# Altium project PPC_notebook_electrical_schematics_v0.7.PrjPcb (part 7 of 14)

## Sheet 16 SATA3 CONTROLLER.SchDoc
size 420 x 297 mm
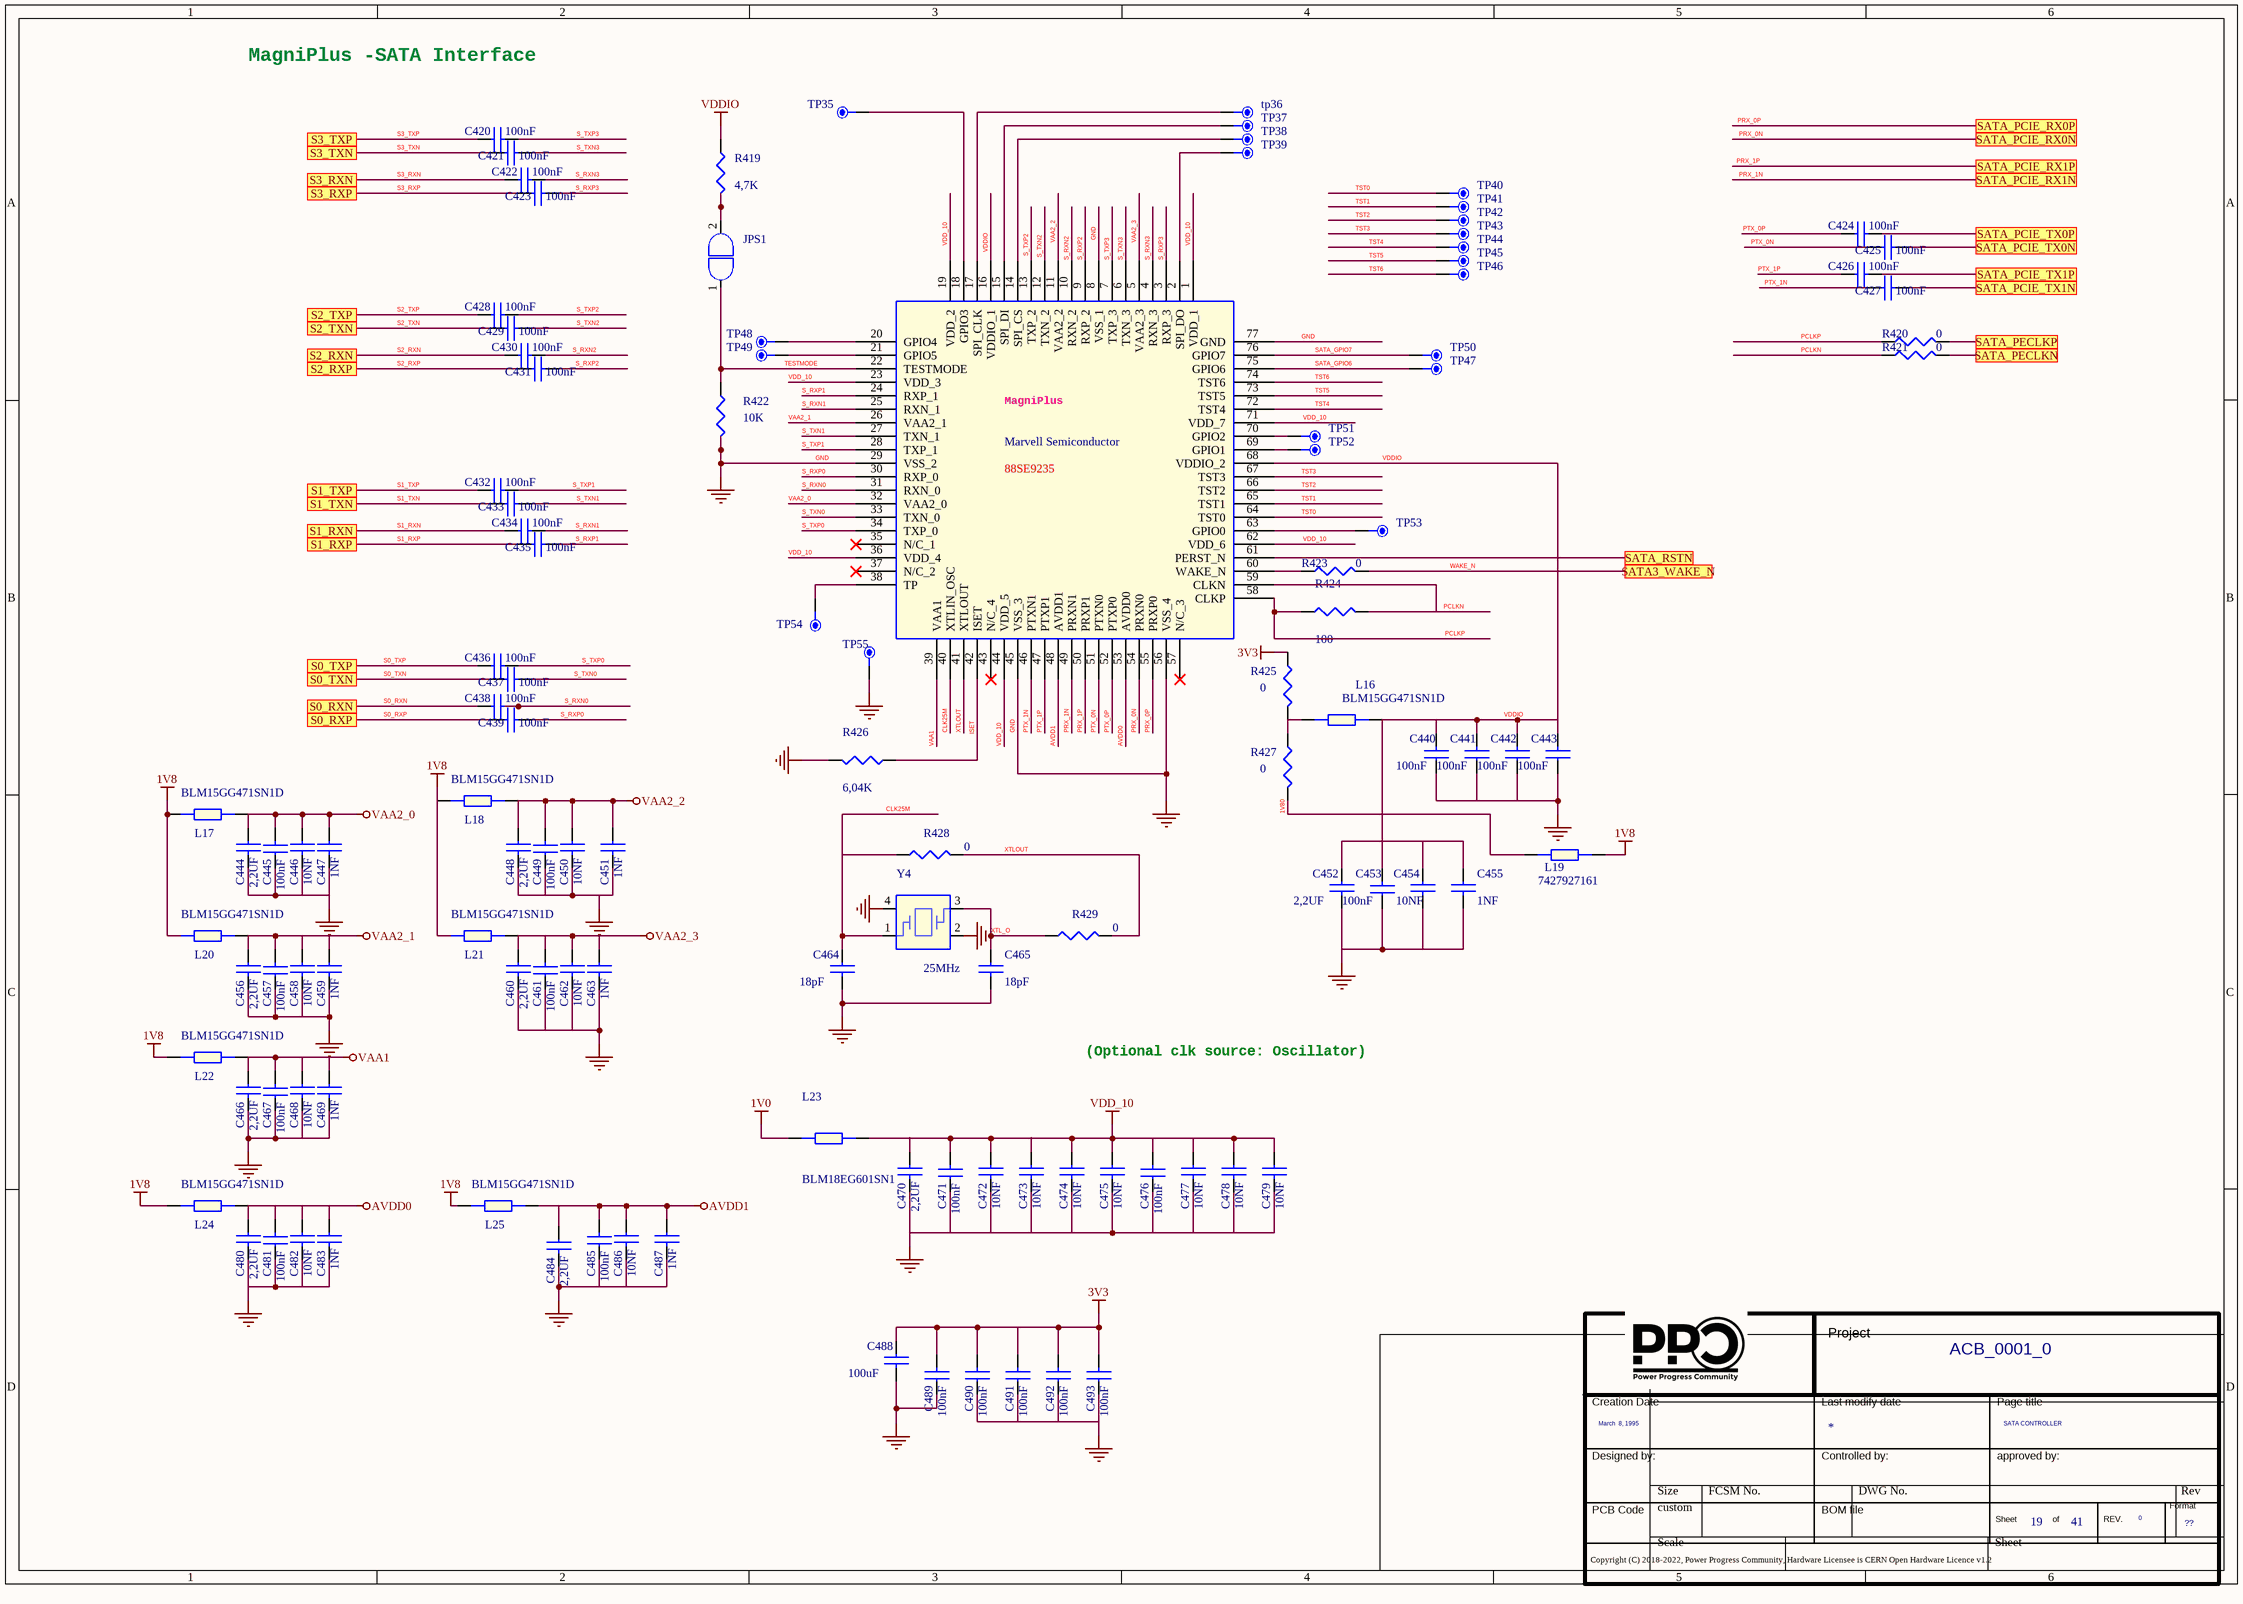
[diagram p32: 16 SATA3 CONTROLLER.SchDoc]

### Parts
(Parts that share a designator on the sheet are numbered #1, #2 ... from top to bottom, then left to right.)
*#22  Page Count: 41  Page Create Date: March  8, 1995  Page Number: 19  Page Size: ??  Page Title: SATA CONTROLLER  RevCode: 0  Title: ACB_0001_0  (hidden comment: Title_block_PPC)  (graphical)
C420  100nF  [SMD_0402]
C421  100nF  [SMD_0402]
C422  100nF  [SMD_0402]
C423  100nF  [SMD_0402]
C424  100nF  [SMD_0402]
C425  100nF  [SMD_0402]
C426  100nF  [SMD_0402]
C427  100nF  [SMD_0402]
C428  100nF  [SMD_0402]
C429  100nF  [SMD_0402]
C430  100nF  [SMD_0402]
C431  100nF  [SMD_0402]
C432  100nF  [SMD_0402]
C433  100nF  [SMD_0402]
C434  100nF  [SMD_0402]
C435  100nF  [SMD_0402]
C436  100nF  [SMD_0402]
C437  100nF  [SMD_0402]
C438  100nF  [SMD_0402]
C439  100nF  [SMD_0402]
C440  100nF  [SMD_0402]
C441  100nF  [SMD_0402]
C442  100nF  [SMD_0402]
C443  100nF  [SMD_0402]
C444  2,2UF  [SMD_0402]
C445  100nF  [SMD_0402]
C446  10NF  [SMD_0402]
C447  1NF  [SMD_0402]
C448  2,2UF  [SMD_0402]
C449  100nF  [SMD_0402]
C450  10NF  [SMD_0402]
C451  1NF  [SMD_0402]
C452  2,2UF  [SMD_0402]
C453  100nF  [SMD_0402]
C454  10NF  [SMD_0402]
C455  1NF  [SMD_0402]
C456  2,2UF  [SMD_0402]
C457  100nF  [SMD_0402]
C458  10NF  [SMD_0402]
C459  1NF  [SMD_0402]
C460  2,2UF  [SMD_0402]
C461  100nF  [SMD_0402]
C462  10NF  [SMD_0402]
C463  1NF  [SMD_0402]
C464  18pF  [SMD_0402]
C465  18pF  [SMD_0402]
C466  2,2UF  [SMD_0402]
C467  100nF  [SMD_0402]
C468  10NF  [SMD_0402]
C469  1NF  [SMD_0402]
C470  2,2UF  [SMD_0402]
C471  100nF  [SMD_0402]
C472  10NF  [SMD_0402]
C473  10NF  [SMD_0402]
C474  10NF  [SMD_0402]
C475  10NF  [SMD_0402]
C476  100nF  [SMD_0402]
C477  10NF  [SMD_0402]
C478  10NF  [SMD_0402]
C479  10NF  [SMD_0402]
C480  2,2UF  [SMD_0402]
C481  100nF  [SMD_0402]
C482  10NF  [SMD_0402]
C483  1NF  [SMD_0402]
C484  2,2UF  [SMD_0402]
C485  100nF  [SMD_0402]
C486  10NF  [SMD_0402]
C487  1NF  [SMD_0402]
C488  100uF  [SMD_0805]
C489  100nF  [SMD_0402]
C490  100nF  [SMD_0402]
C491  100nF  [SMD_0402]
C492  100nF  [SMD_0402]
C493  100nF  [SMD_0402]
JPS1  SOLDER JUMPER X 2  [PCB]  (value not drawn)
L16  BLM15GG471SN1D  [SMD_0402]
L17  BLM15GG471SN1D  [SMD_0402]
L18  BLM15GG471SN1D  [SMD_0402]
L19  7427927161  [SMD_0402]
L20  BLM15GG471SN1D  [SMD_0402]
L21  BLM15GG471SN1D  [SMD_0402]
L22  BLM15GG471SN1D  [SMD_0402]
L23  BLM18EG601SN1  [SMD_0603]
L24  BLM15GG471SN1D  [SMD_0402]
L25  BLM15GG471SN1D  [SMD_0402]
R419  4,7K  [SMD_0402]
R420  0  [SMD_0402]
R421  0  [SMD_0402]
R422  10K  [SMD_0402]
R423  0  [SMD_0402]
R424  100  [SMD_0402]
R425  0  [SMD_0402]
R426  6,04K  [SMD_0603]
R427  0  [SMD_0402]
R428  0  [SMD_0402]
R429  0  [SMD_0402]
TP35  TPS  [TPS]  (value not drawn)
tp36  TPS  [TPS]  (value not drawn)
TP37  TPS  [TPS]  (value not drawn)
TP38  TPS  [TPS]  (value not drawn)
TP39  TPS  [TPS]  (value not drawn)
TP40  TPS  [TPS]  (value not drawn)
TP41  TPS  [TPS]  (value not drawn)
TP42  TPS  [TPS]  (value not drawn)
TP43  TPS  [TPS]  (value not drawn)
TP44  TPS  [TPS]  (value not drawn)
TP45  TPS  [TPS]  (value not drawn)
TP46  TPS  [TPS]  (value not drawn)
TP47  TPS  [TPS]  (value not drawn)
TP48  TPS  [TPS]  (value not drawn)
TP49  TPS  [TPS]  (value not drawn)
TP50  TPS  [TPS]  (value not drawn)
TP51  TPS  [TPS]  (value not drawn)
TP52  TPS  [TPS]  (value not drawn)
TP53  TPS  [TPS]  (value not drawn)
TP54  TPS  [TPS]  (value not drawn)
TP55  TPS  [TPS]  (value not drawn)
U42  Distributor_Part_Number: Marvell Semiconductor  [76-pin QFN 
LBGA-196]  (hidden comment: 88SE9235)
Y4  25MHz  [SMD_5.0x3.2]

### Ports
S0_RXN, S0_RXP, S0_TXN, S0_TXP, S1_RXN, S1_RXP, S1_TXN, S1_TXP, S2_RXN, S2_RXP, S2_TXN, S2_TXP, S3_RXN, S3_RXP, S3_TXN, S3_TXP, SATA3_WAKE_N, SATA_PCIE_RX0N, SATA_PCIE_RX0P, SATA_PCIE_RX1N, SATA_PCIE_RX1P, SATA_PCIE_TX0N, SATA_PCIE_TX0P, SATA_PCIE_TX1N, SATA_PCIE_TX1P, SATA_PECLKN, SATA_PECLKP, SATA_RSTN

### Nets
1V0: L23.1
1V8: L17.1 L18.1 L19.2 L20.1 L21.1 L22.1 L24.1 L25.1
3V3: C488.1 C489.2 C490.2 C491.2 C492.2 C493.2 R425.2
AVDD0: C480.1 C481.2 C482.1 C483.1 L24.2 U42.53(AVDD0)
AVDD1: C484.1 C485.2 C486.1 C487.1 L25.2 U42.48(AVDD1)
GND: C440.1 C441.1 C442.1 C443.1 C444.2 C445.1 C446.2 C447.2 C448.2 C449.1 C450.2 C451.2 C452.2 C453.1 C454.2 C455.2 C456.2 C457.1 C458.2 C459.2 C460.2 C461.1 C462.2 C463.2 C464.2 C465.2 C466.2 C467.1 C468.2 C469.2 C470.2 C471.1 C472.2 C473.2 C474.2 C475.2 C476.1 C477.2 C478.2 C479.2 C480.2 C481.1 C482.2 C483.2 C484.2 C485.1 C486.2 C487.2 C488.2 C489.1 C490.1 C491.1 C492.1 C493.1 R422.2 R426.2 TP55.1 U42.8(VSS_1) U42.29(VSS_2) U42.45(VSS_3) U42.56(VSS_4) U42.77(GND) Y4.2 Y4.4
VAA1: C466.1 C467.2 C468.1 C469.1 L22.2 U42.39(VAA1)
VAA2_0: C444.1 C445.2 C446.1 C447.1 L17.2 U42.32(VAA2_0)
VAA2_1: C456.1 C457.2 C458.1 C459.1 L20.2 U42.26(VAA2_1)
VAA2_2: C448.1 C449.2 C450.1 C451.1 L18.2 U42.11(VAA2_2)
VAA2_3: C460.1 C461.2 C462.1 C463.1 L21.2 U42.5(VAA2_3)
VDD_10: C470.1 C471.2 C472.1 C473.1 C474.1 C475.1 C476.2 C477.1 C478.1 C479.1 L23.2 U42.1(VDD_1) U42.19(VDD_2) U42.23(VDD_3) U42.36(VDD_4) U42.44(VDD_5) U42.62(VDD_6) U42.71(VDD_7)
VDDIO: C440.2 C441.2 C442.2 C443.2 C452.1 C453.2 C454.1 C455.1 L16.1 R419.1 U42.16(VDDIO_1) U42.68(VDDIO_2)
1V80: L19.1 R427.1
CLK25M: C464.1 R428.2 U42.40(XTLIN_OSC) Y4.1
ISET: R426.1 U42.42(ISET)
PCLKN: R421.1 R424.2 U42.59(CLKN)
PCLKP: R420.1 R424.1 U42.58(CLKP)
PRX_0N: U42.54(PRXN0) ; port SATA_PCIE_RX0N
PRX_0P: U42.55(PRXP0) ; port SATA_PCIE_RX0P
PRX_1N: U42.49(PRXN1) ; port SATA_PCIE_RX1N
PRX_1P: U42.50(PRXP1) ; port SATA_PCIE_RX1P
PTX_0N: C425.1 U42.51(PTXN0)
PTX_0P: C424.1 U42.52(PTXP0)
PTX_1N: C427.1 U42.46(PTXN1)
PTX_1P: C426.1 U42.47(PTXP1)
S0_RXN: C438.1 ; port S0_RXN
S0_RXP: C439.1 ; port S0_RXP
S0_TXN: C437.1 ; port S0_TXN
S0_TXP: C436.1 ; port S0_TXP
S1_RXN: C434.1 ; port S1_RXN
S1_RXP: C435.1 ; port S1_RXP
S1_TXN: C433.1 ; port S1_TXN
S1_TXP: C432.1 ; port S1_TXP
S2_RXN: C430.1 ; port S2_RXN
S2_RXP: C431.1 ; port S2_RXP
S2_TXN: C429.1 ; port S2_TXN
S2_TXP: C428.1 ; port S2_TXP
S3_RXN: C422.1 ; port S3_RXN
S3_RXP: C423.1 ; port S3_RXP
S3_TXN: C421.1 ; port S3_TXN
S3_TXP: C420.1 ; port S3_TXP
S_RXN0: C438.2 U42.31(RXN_0)
S_RXN1: C434.2 U42.25(RXN_1)
S_RXN2: C430.2 U42.10(RXN_2)
S_RXN3: C422.2 U42.4(RXN_3)
S_RXP0: C439.2 U42.30(RXP_0)
S_RXP1: C435.2 U42.24(RXP_1)
S_RXP2: C431.2 U42.9(RXP_2)
S_RXP3: C423.2 U42.3(RXP_3)
S_TXN0: C437.2 U42.33(TXN_0)
S_TXN1: C433.2 U42.27(TXN_1)
S_TXN2: C429.2 U42.12(TXN_2)
S_TXN3: C421.2 U42.6(TXN_3)
S_TXP0: C436.2 U42.34(TXP_0)
S_TXP1: C432.2 U42.28(TXP_1)
S_TXP2: C428.2 U42.13(TXP_2)
S_TXP3: C420.2 U42.7(TXP_3)
SATA_GPIO6: TP47.1 U42.75(GPIO6)
SATA_GPIO7: TP50.1 U42.76(GPIO7)
TESTMODE: JPS1.1 R422.1 U42.22(TESTMODE)
TST0: TP40.1 U42.64(TST0)
TST1: TP41.1 U42.65(TST1)
TST2: TP42.1 U42.66(TST2)
TST3: TP43.1 U42.67(TST3)
TST4: TP44.1 U42.72(TST4)
TST5: TP45.1 U42.73(TST5)
TST6: TP46.1 U42.74(TST6)
WAKE_N: R423.2 ; port SATA3_WAKE_N
XTL_O: C465.1 R429.2 Y4.3
XTLOUT: R428.1 R429.1 U42.41(XTLOUT)
NetC109_2: C424.2 ; port SATA_PCIE_TX0P
NetC110_2: C425.2 ; port SATA_PCIE_TX0N
NetC111_2: C426.2 ; port SATA_PCIE_TX1P
NetC112_2: C427.2 ; port SATA_PCIE_TX1N
NetJPS1_2: JPS1.2 R419.2
NetL16_2: L16.2 R425.1 R427.2
NetR286_2: U42.61(PERST_N) ; port SATA_RSTN
NetR420_2: R420.2 ; port SATA_PECLKP
NetR421_2: R421.2 ; port SATA_PECLKN
NetR423_1: R423.1 U42.60(WAKE_N)
NetTP35_1: TP35.1 U42.18(GPIO3)
Nettp36_1: tp36.1 U42.17(SPI_CLK)
NetTP37_1: TP37.1 U42.15(SPI_DI)
NetTP38_1: TP38.1 U42.14(SPI_CS)
NetTP39_1: TP39.1 U42.2(SPI_DO)
NetTP48_1: TP48.1 U42.20(GPIO4)
NetTP49_1: TP49.1 U42.21(GPIO5)
NetTP51_1: TP51.1 U42.70(GPIO2)
NetTP52_1: TP52.1 U42.69(GPIO1)
NetTP53_1: TP53.1 U42.63(GPIO0)
NetTP54_1: TP54.1 U42.38(TP)

Not connected (* = marked no-connect by the designer): U42 35(N/C_1)* 37(N/C_2)* 43(N/C_4)* 57(N/C_3)*

### Notes on the sheet
- MagniPlus -SATA Interface
- (near U42) MagniPlus
- (Optional clk source: Oscillator)

### Library data of the parts
C420 C422 C425 C426 C428 C430 C432 C434 C437 C439 C449 C453 C485 = CAP NP_Dup10: as C498-C500 on sheet 16B Sata Connectors; PCB Footprint: SMD_0402; Distributor 1: MURATA ELETTRONICA SPA; Part Type: Capacitors\Ceramic\SMD\0402
C421 C423 C424 C427 C429 C431 C433 C435 C436 C438 C440-C443 C445 C457 C461 C467 C471 C476 C481 C489-C493 = CAP NP_Dup10: as C495 on sheet 16B Sata Connectors; PCB Footprint: SMD_0402; Part Type: Capacitors\Ceramic\SMD\0402; Distributor 1: MURATA ELETTRONICA SPA
C444 C452 C456 C460 C466 C480 = CAP NP_Dup10: CAP CERAMIC 2.2UF 6.3V X5R 0402; Manufacturer Part Number 1: ECJ-0EB0J225M; Manufacturer 1: Panasonic - ECG; Part Number: PASSIVE_55; RSM: RC0402; PCB Footprint: SMD_0402; Distributor 1: DIGIKEY (PCC2421TR-ND); Part Type: Capacitors\Ceramic\SMD\0402
C446 C458 C462 C468 C472-C475 C477-C479 C482 = CAP NP_Dup10: COND.CER. 10NF 50V 0402 X7R SMD; Manufacturer Part Number 1: C0402C103K5RACTU; Manufacturer 1: KEMET; Part Number: PASSIVE_29; RSM: RC0402; PCB Footprint: SMD_0402; Distributor 1: TTI ITALY SRL; Part Type: Capacitors\Ceramic\SMD\0402
C447 C451 C459 C463 C469 C483 C487 = CAP NP_Dup10: COND.CER. 1NF 50V 0402 NPO SMD; Manufacturer Part Number 1: 223858715523; Manufacturer 1: YAGEO; Part Number: PASSIVE_46; RSM: RC0402; PCB Footprint: SMD_0402; Distributor 1: CLAITRON LASI SILVESTAR S.R.L.; Part Type: Capacitors\Ceramic\SMD\0402
C448 C470 C484 = CAP NP_Dup10: CAP CERAMIC 2.2UF 6.3V X5R 0402; Part Number: PASSIVE_55; Manufacturer 1: Panasonic - ECG; Manufacturer Part Number 1: ECJ-0EB0J225M; RSM: RC0402; PCB Footprint: SMD_0402; Part Type: Capacitors\Ceramic\SMD\0402; Distributor 1: DIGIKEY (PCC2421TR-ND)
C450 C454 C486 = CAP NP_Dup10: COND.CER. 10NF 50V 0402 X7R SMD; Part Number: PASSIVE_29; Manufacturer 1: KEMET; Manufacturer Part Number 1: C0402C103K5RACTU; RSM: RC0402; PCB Footprint: SMD_0402; Part Type: Capacitors\Ceramic\SMD\0402; Distributor 1: TTI ITALY SRL
C455 = CAP NP_Dup10: COND.CER. 1NF 50V 0402 NPO SMD; Part Number: PASSIVE_46; Manufacturer 1: YAGEO; Manufacturer Part Number 1: 223858715523; RSM: RC0402; PCB Footprint: SMD_0402; Part Type: Capacitors\Ceramic\SMD\0402; Distributor 1: CLAITRON LASI SILVESTAR S.R.L.
C464 = CAP NP_Dup10: CAP CER 18PF 50V 5% NP0 0402; Part Number: PASSIVE_43; Manufacturer 1: TDK; Manufacturer Part Number 1: C1005C0G1H180J; RSM: RC0402; PCB Footprint: SMD_0402; Part Type: Capacitors\Ceramic\SMD\0402; Distributor 1: DIGIKEY (445-1238-1-ND)
C465 = CAP NP_Dup10: CAP CER 18PF 50V 5% NP0 0402; Manufacturer Part Number 1: C1005C0G1H180J; Manufacturer 1: TDK; Part Number: PASSIVE_43; RSM: RC0402; PCB Footprint: SMD_0402; Distributor 1: DIGIKEY (445-1238-1-ND); Part Type: Capacitors\Ceramic\SMD\0402
C488 = CAP NP_Dup10: CAP CER 100UF 6.3V 20% X5R 0805; Manufacturer Part Number 1: GRM21BR60J107ME15L; Manufacturer 1: Murata; Part Number: PASSIVE_202; RSM: RC0805; PCB Footprint: SMD_0805; Distributor 1: FARNELL(2494476); Part Type: Capacitors\Ceramic\SMD\0805
JPS1 = SOLDER JUMPER 2x1: SODER JUMPER SU PCB; Part Number: CONNECTORS_335; RSM: JMPS2; PCB Footprint: PCB; Part Type: SOLDER JUMPER
L16 L18 L25 = FERRITE_BEAD_Dup1: FERRITE CHIP 470 OHM 200MA 0402; Manufacturer 1: Murata; Part Number: PASSIVE_371; RSM: RC0402; PCB Footprint: SMD_0402; Distributor 1: DIGIKEY (	490-5198-1-ND); Manufacturer Part Number 1: BLM15GG471SN1D; Part Type: Ferrite Beads\SMD\0402
L17 L20-L22 L24 = FERRITE_BEAD_Dup1: FERRITE CHIP 470 OHM 200MA 0402; Part Number: PASSIVE_371; Manufacturer 1: Murata; RSM: RC0402; PCB Footprint: SMD_0402; Part Type: Ferrite Beads\SMD\0402; Manufacturer Part Number 1: BLM15GG471SN1D; Distributor 1: DIGIKEY (	490-5198-1-ND)
L19 = FERRITE_BEAD: FERRITE BEAD 600R 0.25A 0402; Part Number: PASSIVE_369; Manufacturer 1: WURTH; RSM: RC0402; PCB Footprint: SMD_0402; Part Type: Ferrite Beads\SMD\0402; Manufacturer Part Number 1: 7427927161
L23 = FERRITE_BEAD: FERRITE BEAD 600ohm 500mA 0603 SMD; Part Number: PASSIVE_377; Manufacturer 1: Murata; Manufacturer Part Number 1: BLM18EG601SN1 SMD; RSM: RC0603; Part Type: Ferrite Beads\SMD\0603; PCB Footprint: SMD_0603
R419 = R_Dup9: RESIS.CHIP 4,7K 5% 0402 SMD; Part Number: PASSIVE_861; Manufacturer 1: ROYAL OHM; RSM: RC0402; PCB Footprint: SMD_0402; Part Type: Resistors\Fixed\SMD\0402\5%; Manufacturer Part Number 1: RESIS.CHIP 4,7K 5% 0402 SMD; Distributor 1: CAMEL ELETTRONICA SRL  #
R420 R421 R423 R425 R427-R429 = R_Dup9: as R433-R437 on sheet 16B Sata Connectors; PCB Footprint: SMD_0402; Distributor 1: CAMEL ELETTRONICA SRL  #; Manufacturer Part Number 1: RESIS.CHIP 0R 5% 0402 SMD; Part Type: Resistors\Fixed\SMD\0402\5%
R422 = R_Dup6: RESIS.CHIP 10K 1% 0402 SMD; Part Number: PASSIVE_584; Manufacturer 1: ROYAL OHM; RSM: RC0402; Part Type: Resistors\Fixed\SMD\0402\1%; PCB Footprint: SMD_0402; Manufacturer Part Number 1: RESIS.CHIP 10K 1% 0402 SMD
R424 = R_Dup6: RESIS.CHIP 100R 5% 0402 SMD; Part Number: PASSIVE_812; Manufacturer 1: ROYAL OHM; RSM: RC0402; Part Type: Resistors\Fixed\SMD\0402\5%; PCB Footprint: SMD_0402; Manufacturer Part Number 1: RESIS.CHIP 100R 5% 0402 SMD
R426 = R_Dup6: RESIS.CHIP 6K04 1% 0603 SMD; Part Number: PASSIVE_1047; Manufacturer 1: ROYAL OHM; RSM: RC0603; Part Type: Resistors\Fixed\SMD\0603\1%; PCB Footprint: SMD_0603; Manufacturer Part Number 1: RESIS.CHIP 6K04 1% 0603 SMD
TP35 tp36 TP37-TP55 = TPS_2: Test Point, .025 sq pin; MFR_Name: Samtec; Mfr_Part_Number: Cut From Strip; PCB Footprint: tp36; RSM: AE-TESTPOINT; Distributor_Part_Number: no parts needed
U42 = 2020_34: Two-Lane PCIe 2.0 to Four-Port 6; Mfr_Part_Number: 88SE9230; MFR_Name: Marvell Semi; Part Number: LOGIC_356; Manufacturer 1: MARVELL; RSM: QFN-76-EP_9X9; PCB Footprint: 76-pin QFN / LBGA-196; Display Value: 88SE9235; Distributor: tbd; Part Type: PCIE\SATA; Manufacturer Part Number 1: 88SE9235; Distributor 1: MARVELL(88SE9235A1-NAA2C000)
Y4 = CRYSTAL_4P_Dup2: CRYSTAL 25.000 MHZ 20PF SMD; Part Number: MISC_166; Manufacturer 1: ECS; Manufacturer Part Number 1: ECS-250-20-30B-TR (ROHS COMPLIANT); RSM: XC-CSX2; PCB Footprint: SMD_5.0x3.2; Part Type: Quartz; Distributor 1: DIGIKEY (XC1124CT-ND)
*#22 = Title_block_PPC: Page Modify Date: *

## Sheet 17 USB3 CONTROLLER.SchDoc
size 594 x 420 mm
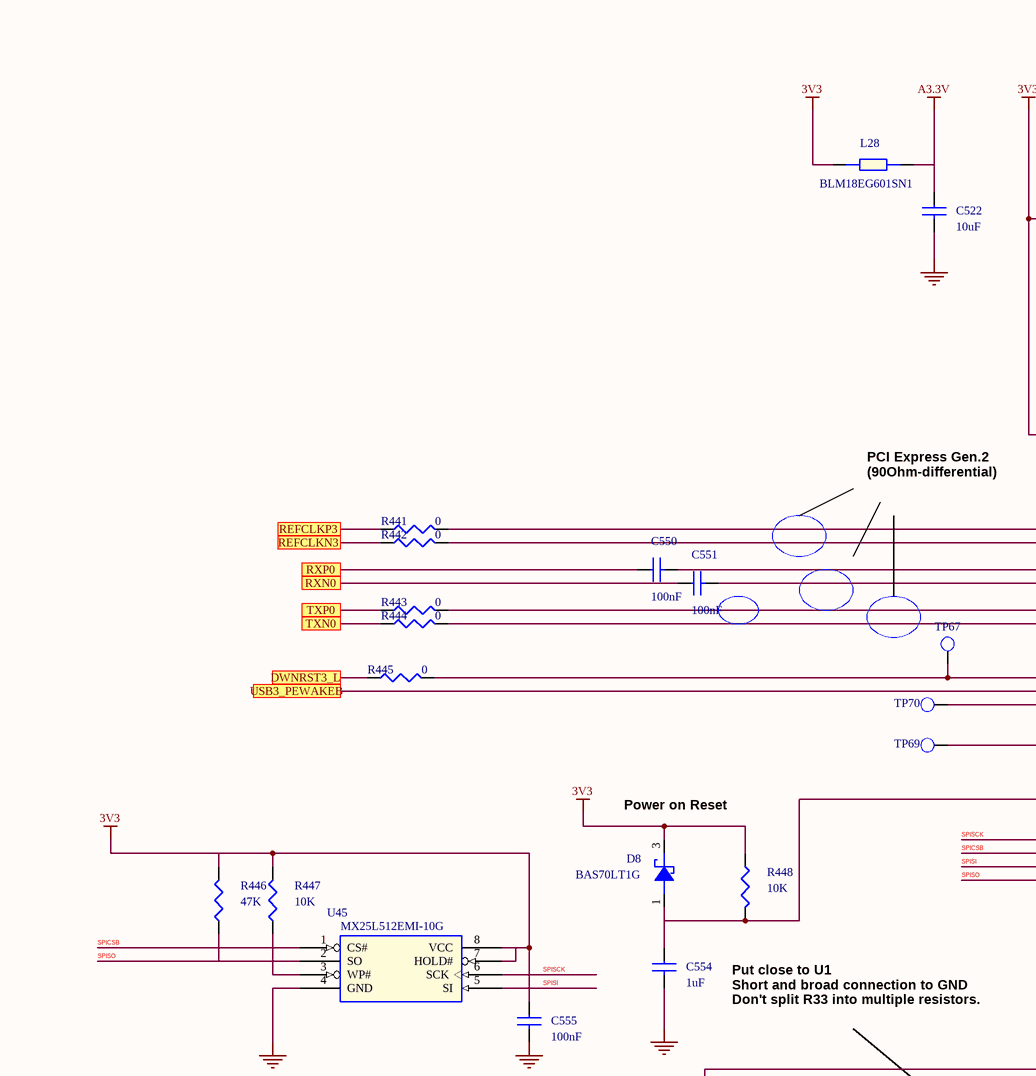
[diagram p33: 17 USB3 CONTROLLER.SchDoc, top left]
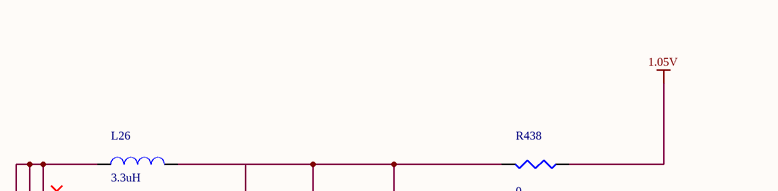
[diagram p34: 17 USB3 CONTROLLER.SchDoc, top right]
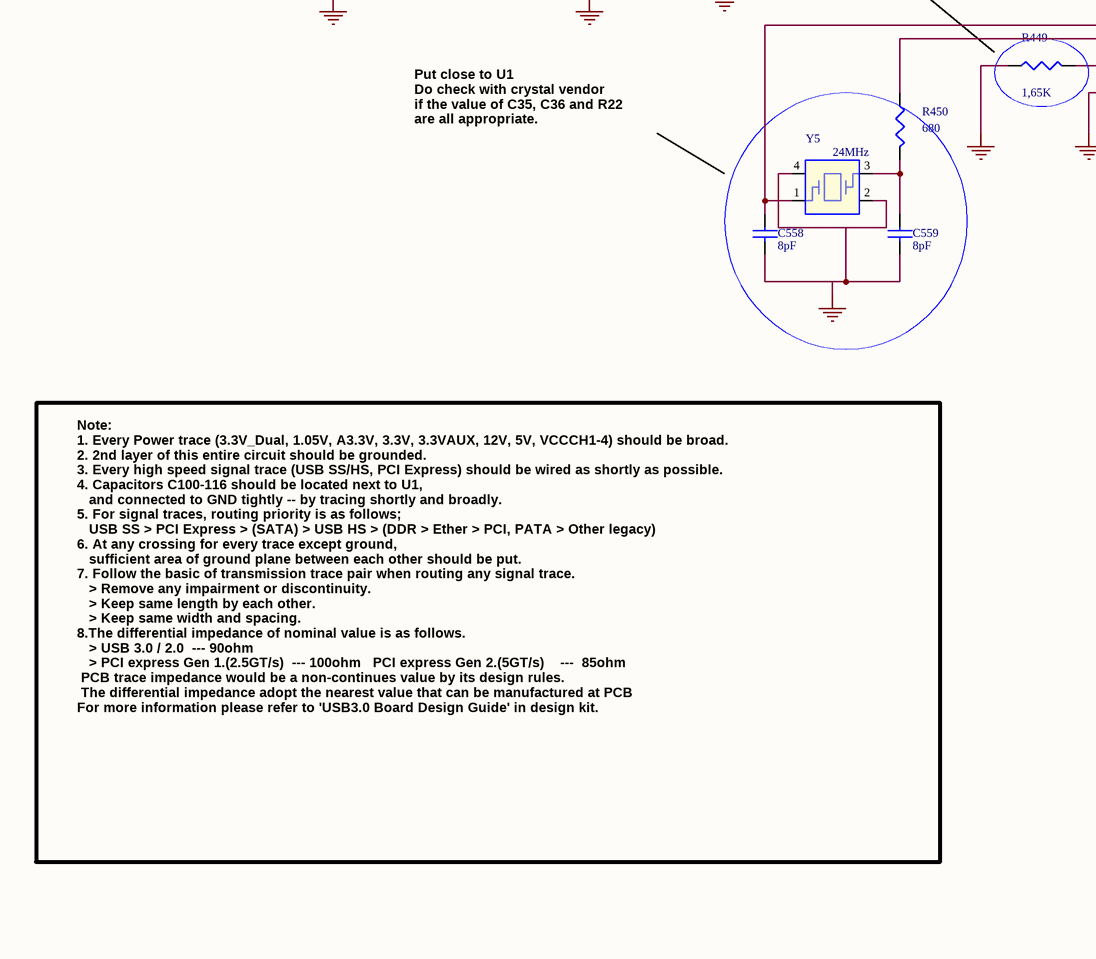
[diagram p35: 17 USB3 CONTROLLER.SchDoc, bottom left]
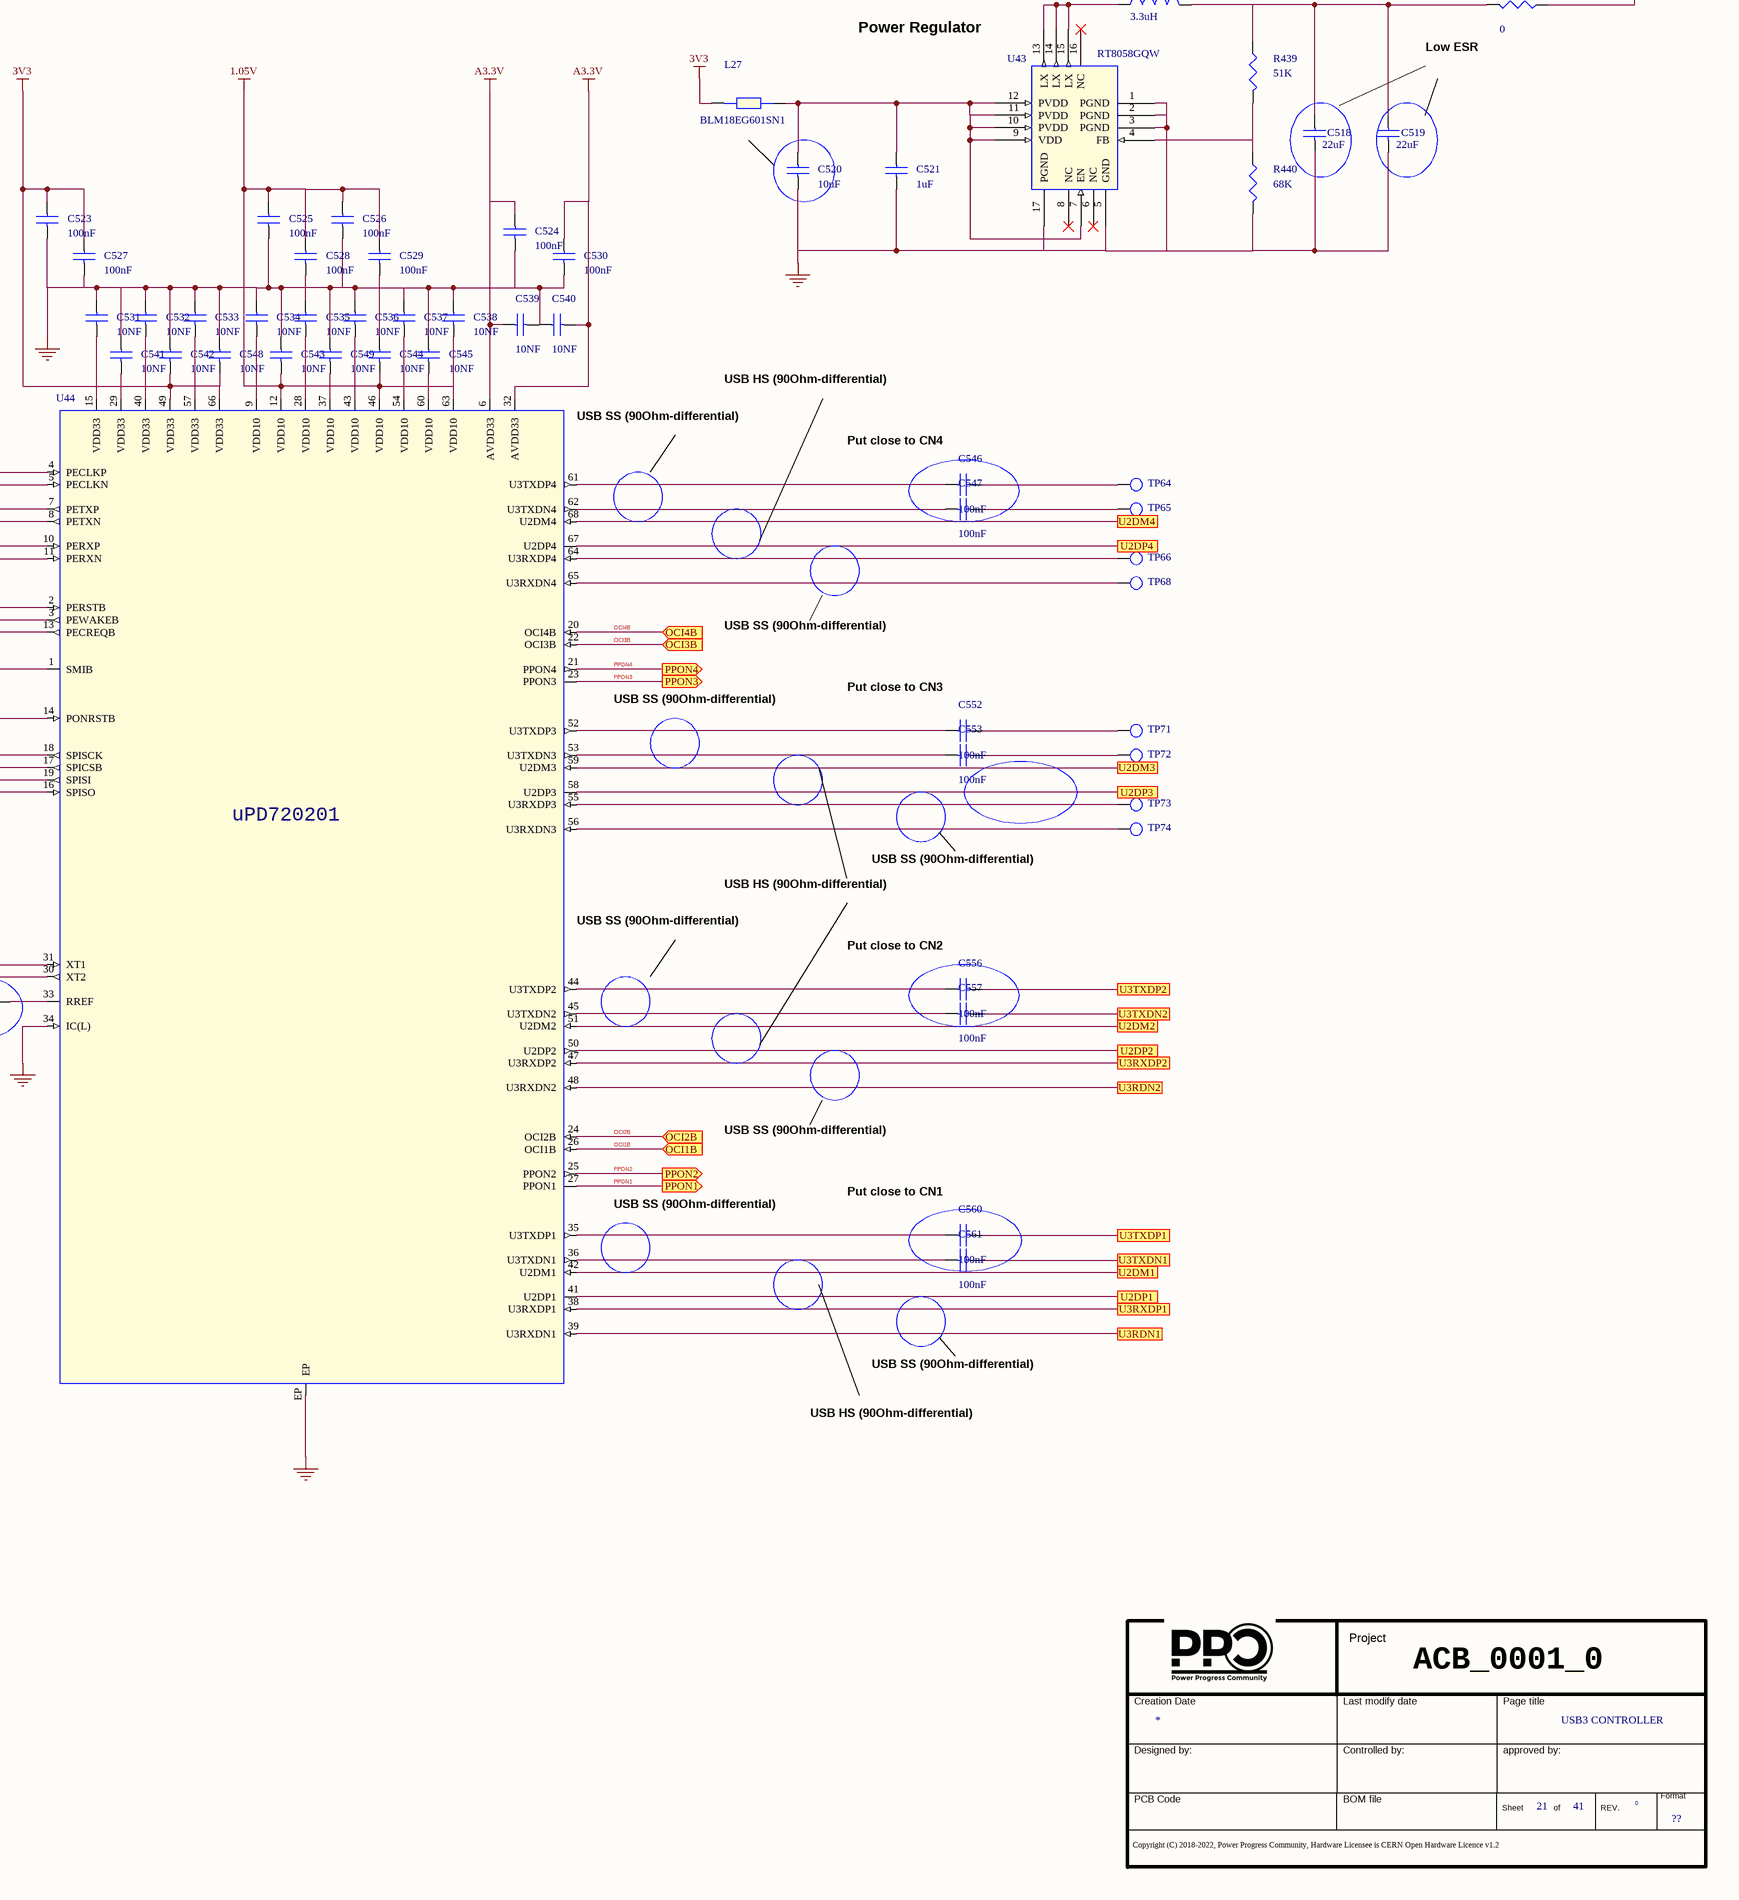
[diagram p36: 17 USB3 CONTROLLER.SchDoc, bottom right]

### Parts
(Parts that share a designator on the sheet are numbered #1, #2 ... from top to bottom, then left to right.)
*#23  Doc: USB3 CONTROLLER  Page Count: 41  Page Number: 21  Page Size: ??  RevCode: 0  (hidden comment: Title_block_PPC)  (graphical)
C518  22uF  [SMD_0805]
C519  22uF  [SMD_0805]
C520  10uF  [SMD_0603]
C521  1uF  [SMD_0402]
C522  10uF  [SMD_0603]
C523  100nF  [SMD_0402]
C524  100nF  [SMD_0402]
C525  100nF  [SMD_0402]
C526  100nF  [SMD_0402]
C527  100nF  [SMD_0402]
C528  100nF  [SMD_0402]
C529  100nF  [SMD_0402]
C530  100nF  [SMD_0402]
C531  10NF  [SMD_0402]
C532  10NF  [SMD_0402]
C533  10NF  [SMD_0402]
C534  10NF  [SMD_0402]
C535  10NF  [SMD_0402]
C536  10NF  [SMD_0402]
C537  10NF  [SMD_0402]
C538  10NF  [SMD_0402]
C539  10NF  [SMD_0402]
C540  10NF  [SMD_0402]
C541  10NF  [SMD_0402]
C542  10NF  [SMD_0402]
C543  10NF  [SMD_0402]
C544  10NF  [SMD_0402]
C545  10NF  [SMD_0402]
C546  100nF  [SMD_0402]
C547  100nF  [SMD_0402]
C548  10NF  [SMD_0402]
C549  10NF  [SMD_0402]
C550  100nF  [SMD_0402]
C551  100nF  [SMD_0402]
C552  100nF  [SMD_0402]
C553  100nF  [SMD_0402]
C554  1uF  [SMD_0402]
C555  100nF  [SMD_0603]
C556  100nF  [SMD_0402]
C557  100nF  [SMD_0402]
C558  8pF  [SMD_0402]
C559  8pF  [SMD_0402]
C560  100nF  [SMD_0402]
C561  100nF  [SMD_0402]
D8  BAS70LT1G  [SOT-23]
L26  3.3uH  [SMD_SRU1028]
L27  BLM18EG601SN1  [SMD_0603]
L28  BLM18EG601SN1  [SMD_0603]
R438  0  [SMD_1206]
R439  51K  [SMD_0402]
R440  68K  [SMD_0402]
R441  0  [SMD_0402]
R442  0  [SMD_0402]
R443  0  [SMD_0402]
R444  0  [SMD_0402]
R445  0  [SMD_0402]
R446  47K  [SMD_0402]
R447  10K  [SMD_0402]
R448  10K  [SMD_0402]
R449  1,65K  [SMD_0402]
R450  680  [SMD_0402]
TP64  TEST POINT  [PCB]  (value not drawn)
TP65  TEST POINT  [PCB]  (value not drawn)
TP66  TEST POINT  [PCB]  (value not drawn)
TP67  TEST POINT  [PCB]  (value not drawn)
TP68  TEST POINT  [PCB]  (value not drawn)
TP69  TEST POINT  [PCB]  (value not drawn)
TP70  TEST POINT  [PCB]  (value not drawn)
TP71  TEST POINT  [PCB]  (value not drawn)
TP72  TEST POINT  [PCB]  (value not drawn)
TP73  TEST POINT  [PCB]  (value not drawn)
TP74  TEST POINT  [PCB]  (value not drawn)
U43  RT8058GQW  [QFN16]
U44  UPD720201K8-701-BAC-A  [QFN_68]  (value not drawn)
U45  MX25L512EMI-10G  [SOP-8]
Y5  24MHz  [SMD_2.5x3.2]

### Ports
DWNRST3_L, OCI1B (in), OCI2B (in), OCI3B (in), OCI4B (in), PPON1 (out), PPON2 (out), PPON3 (out), PPON4 (out), REFCLKN3, REFCLKP3, RXN0, RXP0, TXN0, TXP0, U2DM1, U2DM2, U2DM3, U2DM4, U2DP1, U2DP2, U2DP3, U2DP4, U3RDN1, U3RDN2, U3RXDP1, U3RXDP2, U3TXDN1, U3TXDN2, U3TXDP1, U3TXDP2, USB3_PEWAKEB

### Nets
1.05V: C525.1 C526.1 C528.1 C529.1 C534.2 C535.2 C536.2 C537.2 C538.2 C543.2 C544.2 C545.2 C549.2 R438.2 U44.9(VDD10) U44.12(VDD10) U44.28(VDD10) U44.37(VDD10) U44.43(VDD10) U44.46(VDD10) U44.54(VDD10) U44.60(VDD10) U44.63(VDD10)
3V3: C523.1 C527.1 C531.2 C532.2 C533.2 C541.2 C542.2 C548.2 C555.1 D8.3(CATHODE) L27.1 L28.1 R446.2 R447.2 R448.1 U44.15(VDD33) U44.29(VDD33) U44.40(VDD33) U44.49(VDD33) U44.57(VDD33) U44.66(VDD33) U45.7(HOLD#) U45.8(VCC)
A3.3V: C522.1 C524.1 C530.1 C539.1 C540.2 L28.2 U44.6(AVDD33) U44.32(AVDD33)
GND: C518.2 C519.2 C520.2 C521.2 C522.2 C523.2 C524.2 C525.2 C526.2 C527.2 C528.2 C529.2 C530.2 C531.1 C532.1 C533.1 C534.1 C535.1 C536.1 C537.1 C538.1 C539.2 C540.1 C541.1 C542.1 C543.1 C544.1 C545.1 C548.1 C549.1 C554.2 C555.2 C558.2 C559.2 R440.1 R449.2 U43.1(PGND) U43.2(PGND) U43.3(PGND) U43.5(GND) U43.17(PGND) U44.34(IC(L)) U44.EP U45.4(GND) Y5.2 Y5.4
DWNRST3_L: R445.1 ; port DWNRST3_L
OCI1B: U44.26(OCI1B) ; port OCI1B
OCI2B: U44.24(OCI2B) ; port OCI2B
OCI3B: U44.22(OCI3B) ; port OCI3B
OCI4B: U44.20(OCI4B) ; port OCI4B
PPON1: U44.27(PPON1) ; port PPON1
PPON2: U44.25(PPON2) ; port PPON2
PPON3: U44.23(PPON3) ; port PPON3
PPON4: U44.21(PPON4) ; port PPON4
RXN0: C551.1 ; port RXN0
RXP0: C550.1 ; port RXP0
SPICSB: U44.17(SPICSB) U45.1(CS#)
SPISCK: U44.18(SPISCK) U45.6(SCK)
SPISI: U44.19(SPISI) U45.5(SI)
SPISO: R446.1 U44.16(SPISO) U45.2(SO)
TXN0: R444.1 ; port TXN0
TXP0: R443.1 ; port TXP0
NetC518_1: C518.1 C519.1 L26.2 R438.1 R439.2
NetC520_1: C520.1 C521.1 L27.2 U43.7(EN) U43.9(VDD) U43.10(PVDD) U43.11(PVDD) U43.12(PVDD)
NetC546_1: C546.1 U44.61(U3TXDP4)
NetC546_2: C546.2 TP64.1(TP)
NetC547_1: C547.1 U44.62(U3TXDN4)
NetC547_2: C547.2 TP65.1(TP)
NetC550_2: C550.2 U44.7(PETXP)
NetC551_2: C551.2 U44.8(PETXN)
NetC552_1: C552.1 U44.52(U3TXDP3)
NetC552_2: C552.2 TP71.1(TP)
NetC553_1: C553.1 U44.53(U3TXDN3)
NetC553_2: C553.2 TP72.1(TP)
NetC554_1: C554.1 D8.1(ANODE) R448.2 U44.14(PONRSTB)
NetC556_1: C556.1 U44.44(U3TXDP2)
NetC556_2: C556.2 ; port U3TXDP2
NetC557_1: C557.1 U44.45(U3TXDN2)
NetC557_2: C557.2 ; port U3TXDN2
NetC558_1: C558.1 U44.31(XT1) Y5.1
NetC559_1: C559.1 R450.1 Y5.3
NetC560_1: C560.1 U44.35(U3TXDP1)
NetC560_2: C560.2 ; port U3TXDP1
NetC561_1: C561.1 U44.36(U3TXDN1)
NetC561_2: C561.2 ; port U3TXDN1
NetFL4_1: U44.50(U2DP2) ; port U2DP2
NetFL4_4: U44.51(U2DM2) ; port U2DM2
NetFL5_1: U44.47(U3RXDP2) ; port U3RXDP2
NetFL5_4: U44.48(U3RXDN2) ; port U3RDN2
NetFL7_1: U44.41(U2DP1) ; port U2DP1
NetFL7_4: U44.42(U2DM1) ; port U2DM1
NetFL8_1: U44.38(U3RXDP1) ; port U3RXDP1
NetFL8_4: U44.39(U3RXDN1) ; port U3RDN1
NetFL9_1: U44.68(U2DM4) ; port U2DM4
NetFL9_4: U44.67(U2DP4) ; port U2DP4
NetFL11_1: U44.59(U2DM3) ; port U2DM3
NetFL11_4: U44.58(U2DP3) ; port U2DP3
NetL26_1: L26.1 U43.13(LX) U43.14(LX) U43.15(LX)
NetR294_2: U44.3(PEWAKEB) ; port USB3_PEWAKEB
NetR439_1: R439.1 R440.2 U43.4(FB)
NetR441_1: R441.1 ; port REFCLKP3
NetR441_2: R441.2 U44.4(PECLKP)
NetR442_1: R442.1 ; port REFCLKN3
NetR442_2: R442.2 U44.5(PECLKN)
NetR443_2: R443.2 U44.10(PERXP)
NetR444_2: R444.2 U44.11(PERXN)
NetR445_2: R445.2 TP67.1(TP) U44.2(PERSTB)
NetR447_1: R447.1 U45.3(WP#)
NetR449_1: R449.1 U44.33(RREF)
NetR450_2: R450.2 U44.30(XT2)
NetTP66_1: TP66.1(TP) U44.64(U3RXDP4)
NetTP68_1: TP68.1(TP) U44.65(U3RXDN4)
NetTP69_1: TP69.1(TP) U44.1(SMIB)
NetTP70_1: TP70.1(TP) U44.13(PECREQB)
NetTP73_1: TP73.1(TP) U44.55(U3RXDP3)
NetTP74_1: TP74.1(TP) U44.56(U3RXDN3)

Not connected (* = marked no-connect by the designer): U43 6(NC)* 8(NC)* 16(NC)*

### Notes on the sheet
- Power Regulator
- (near R438) Low ESR
- (near U44) PCI Express Gen.2
  (90Ohm-differential)
- (near U44) USB SS (90Ohm-differential)
- USB HS (90Ohm-differential)
- (near C546) Put close to CN4
- USB SS (90Ohm-differential)
- Power on Reset
- (near C552) Put close to CN3
- (near U44) Put close to U1
  Short and broad connection to GND
  Don't split R33 into multiple resistors.
- (near C556) Put close to CN2
- Put close to U1
  Do check with crystal vendor
  if the value of C35, C36 and R22
  are all appropriate.
- (near C560) Put close to CN1
- Note:
  1. Every Power trace (3.3V_Dual, 1.05V, A3.3V, 3.3V, 3.3VAUX, 12V, 5V, VCCCH1-4) should be broad.
  2. 2nd layer of this entire circuit should be grounded.
  3. Every high speed signal trace (USB SS/HS, PCI Express) should be wired as shortly as possible.
  4. Capacitors C100-116 should be located next to U1,
  and connected to GND tightly -- by tracing shortly and broadly.
  5. For signal traces, routing priority is as follows;
  USB SS > PCI Express > (SATA) > USB HS > (DDR > Ether > PCI, PATA > Other legacy)
  6. At any crossing for every trace except ground,
  sufficient area of ground plane between each other should be put.
  7. Follow the basic of transmission trace pair when routing any signal trace.
  > Remove any impairment or discontinuity.
  > Keep same length by each other.
  > Keep same width and spacing.
  8.The differential impedance of nominal value is as follows.
  > USB 3.0 / 2.0  --- 90ohm
  > PCI express Gen 1.(2.5GT/s)  --- 100ohm   PCI express Gen 2.(5GT/s)    ---  85ohm
  PCB trace impedance would be a non-continues value by its design rules.
  The differential impedance adopt the nearest value that can be manufactured at PCB
  For more information please refer to 'USB3.0 Board Design Guide' in design kit.
- ACB_0001_0
- (in symbol uPD720171_0) uPD720201

### Library data of the parts
*#23 = Title_block_PPC: Title: T2080PCIe; Author: MICETEK; Page Create Date: March  8, 1995; Page Title: ?; Page Modify Date: *
C518 C519 = CAP NP_Dup7: 22UF 35V 20% 0805; Part Number: PASSIVE_224; Manufacturer 1: TDK; Manufacturer Part Number 1: C2012X5R1V226M125AC; RSM: RC0805; Part Type: Capacitors\Ceramic\SMD\0805; PCB Footprint: SMD_0805
C520 = CAP NP_Dup3: COND.CER.10uF 0603 25V SMD; Part Number: PASSIVE_124; Manufacturer 1: SAMSUNG; Manufacturer Part Number 1: CL10A106MA8NRNC; RSM: RC0603; Part Type: Capacitors\Ceramic\SMD\0603; PCB Footprint: SMD_0603
C521 C554 = CAP NP_Dup3: CAP CER 1UF 25V X6S 0402; Part Number: PASSIVE_1446; Manufacturer 1: Murata; Manufacturer Part Number 1: GRM155C81E105KE11D; RSM: RC0402; Part Type: Capacitors\Ceramic\SMD\0402; PCB Footprint: SMD_0402
C522 = CAP NP_Dup3: as C394 on sheet 14 EC1 PHY; PCB Footprint: SMD_0603; Part Type: Capacitors\Ceramic\SMD\0603
C523-C530 C546 C547 C550-C553 C556 C557 C560 C561 = CAP NP_Dup3: COND.CER. 100NF 50V 0402 X7R SMD; Manufacturer Part Number 1: CGA2B3X7R1H104M050BD; Manufacturer 1: TDK; Part Number: PASSIVE_24; RSM: RC0402; PCB Footprint: SMD_0402; Part Type: Capacitors\Ceramic\SMD\0402
C531-C545 C548 C549 = CAP NP_Dup3: COND.CER. 10NF 50V 0402 X7R SMD; Part Number: PASSIVE_29; Manufacturer 1: KEMET; Manufacturer Part Number 1: C0402C103K5RACTU; RSM: RC0402; Part Type: Capacitors\Ceramic\SMD\0402; PCB Footprint: SMD_0402
C555 = CAP NP_Dup3: COND.CER.100NF 50V 0603 X7R SMD; Manufacturer Part Number 1: ECJ1VB1H104K; Manufacturer 1: PANASONIC; Part Number: PASSIVE_118; RSM: RC0603; PCB Footprint: SMD_0603; Part Type: Capacitors\Ceramic\SMD\0603
C558 C559 = CAP NP_Dup8: CAP CER 8PF 50V C0G/NPO 0402; Manufacturer Part Number 1: CC0402DRNPO9BN8R0; Manufacturer 1: YAGEO; Part Number: PASSIVE_1461; RSM: RC0402; PCB Footprint: SMD_0402; Part Type: Capacitors\Ceramic\SMD\0402
D8 = diode_schottky_SOT23: DIODE SCHOTTKY 70V SOT23; Part Number: DISCRETE_83; Manufacturer 1: ON_SEMI; Part Type: Diodes\SCHOTTKY; Manufacturer Part Number 1: BAS70LT1G; Distributor 1: DIGIKEY (BAS70LT1GOSCT-ND); PCB Footprint: SOT-23; RSM: SOT-23
L26 = INDUCTOR_Dup1: INDUCTOR SHIELD PWR 3.3UH SMD; Part Number: PASSIVE_533; Manufacturer 1: BOURNS INC.; Manufacturer Part Number 1: SRU1028-3R3Y; RSM: IND-BOURNS-SRU1028; Part Type: Inductors\SMD\SRU1028; PCB Footprint: SMD_SRU1028
L27 L28 = FERRITE_BEAD: FERRITE BEAD 600ohm 500mA 0603 SMD; Manufacturer Part Number 1: BLM18EG601SN1 SMD; Manufacturer 1: Murata; Part Number: PASSIVE_377; RSM: RC0603; PCB Footprint: SMD_0603; Part Type: Ferrite Beads\SMD\0603
R438 = R_Dup6: RESIS. 0R 1/4W 1206 SMD E96; Part Number: PASSIVE_1266; Manufacturer 1: YAGEO; Manufacturer Part Number 1: RC1206JR-070RL; RSM: RC1206; Part Type: Resistors\Fixed\SMD\1206\5%; PCB Footprint: SMD_1206
R439 = R_Dup6: RESIS.CHIP 51K 1% 0402 SMD; Part Number: PASSIVE_752; Manufacturer 1: ROYAL OHM; RSM: RC0402; Part Type: Resistors\Fixed\SMD\0402\1%; PCB Footprint: SMD_0402; Manufacturer Part Number 1: RESIS.CHIP 51K 1% 0402 SMD
R440 = R_Dup6: RESIS.CHIP 68K 1% 0402 SMD; Manufacturer Part Number 1: RESIS.68K 1% 0402 SMD; Manufacturer 1: ROYAL OHM; Part Number: PASSIVE_1435; RSM: RC0402; PCB Footprint: SMD_0402; Part Type: Resistors\Fixed\SMD\0402\1%
R441-R445 = R_Dup6: RESIS.CHIP 0R 5% 0402 SMD; Manufacturer 1: ROYAL OHM; Part Number: PASSIVE_805; RSM: RC0402; PCB Footprint: SMD_0402; Distributor 1: CAMEL ELETTRONICA SRL  #; Manufacturer Part Number 1: RESIS.CHIP 0R 5% 0402 SMD; Part Type: Resistors\Fixed\SMD\0402\5%
R446 = R_Dup6: RESIS.CHIP 47K 1% 0402 SMD; Manufacturer 1: ROYAL OHM; Part Number: PASSIVE_737; RSM: RC0402; Manufacturer Part Number 1: RESIS.CHIP 47K 1% 0402 SMD; PCB Footprint: SMD_0402; Part Type: Resistors\Fixed\SMD\0402\1%
R447 R448 = R_Dup6: as R422 on sheet 16 SATA3 CONTROLLER; Part Type: Resistors\Fixed\SMD\0402\1%; PCB Footprint: SMD_0402; Manufacturer Part Number 1: RESIS.CHIP 10K 1% 0402 SMD
R449 = R_Dup6: RESIS.CHIP 1K65 1% 0402 SMD; Manufacturer Part Number 1: ERJ-2RKF1651X; Manufacturer 1: PANASONIC; Part Number: PASSIVE_576; RSM: RC0402; PCB Footprint: SMD_0402; Part Type: Resistors\Fixed\SMD\0402\1%
R450 = R_Dup6: RES SMD 680 OHM 1% 1/16W 0402; Manufacturer Part Number 1: RC0402FR-07680RL; Manufacturer 1: YAGEO; Part Number: PASSIVE_774; RSM: RC0402; PCB Footprint: SMD_0402; Part Type: Resistors\Fixed\SMD\0402\1%
TP64-TP74 = T POINT R_Dup1: as TP56-TP63 on sheet 16B Sata Connectors; Part Type: Tpoint; PCB Footprint: PCB
U43 = RT8058PQW_1: IC REG BUCK ADJUSTABLE 2A 16WQFN; Manufacturer 1: Richtek; Part Number: LINEAR_327; RSM: QFN-16-3X3-EP; Distributor 1: DIGIKEY (1028-1000-1-ND); Manufacturer Part Number 1: RT8058GQW; Part Type: Regulators\Switching; PCB Footprint: QFN16
U44 = uPD720171_0: Speed Host Controller USB 3.0 3.3V; Manufacturer 1: RENESAS; Part Number: LOGIC_352; RSM: QFN-68-EP_8X8; Distributor 1: ARROW(UPD720201K8-701-BAC-A); Manufacturer Part Number 1: UPD720201K8-701-BAC-A; Part Type: PCIE\PCIE_USB3; PCB Footprint: QFN_68
U45 = AT25640_1: IC FLASH 512K SPI 104MHZ 8SOP; Manufacturer 1: MACRONIX; Part Number: MEMORIES_104; Distributor 1: DIGIKEY(1092-1110-ND); Manufacturer Part Number 1: MX25L512EMI-10G; PCB Footprint: SOP-8; Part Type: FLASH; RSM: SOP-8
Y5 = CRYSTAL_4P: CRYSTAL 24MHZ 10PF SMD; Part Number: MISC_160; Manufacturer 1: CTS; Manufacturer Part Number 1: 403C11A24M00000; RSM: XC-CTS-632; Part Type: Quartz; Distributor 1: DIGIKEY(CTX849CT-ND); PCB Footprint: SMD_2.5x3.2

## Sheet 18B_ETHERNET CARD.SchDoc
size 297 x 209 mm
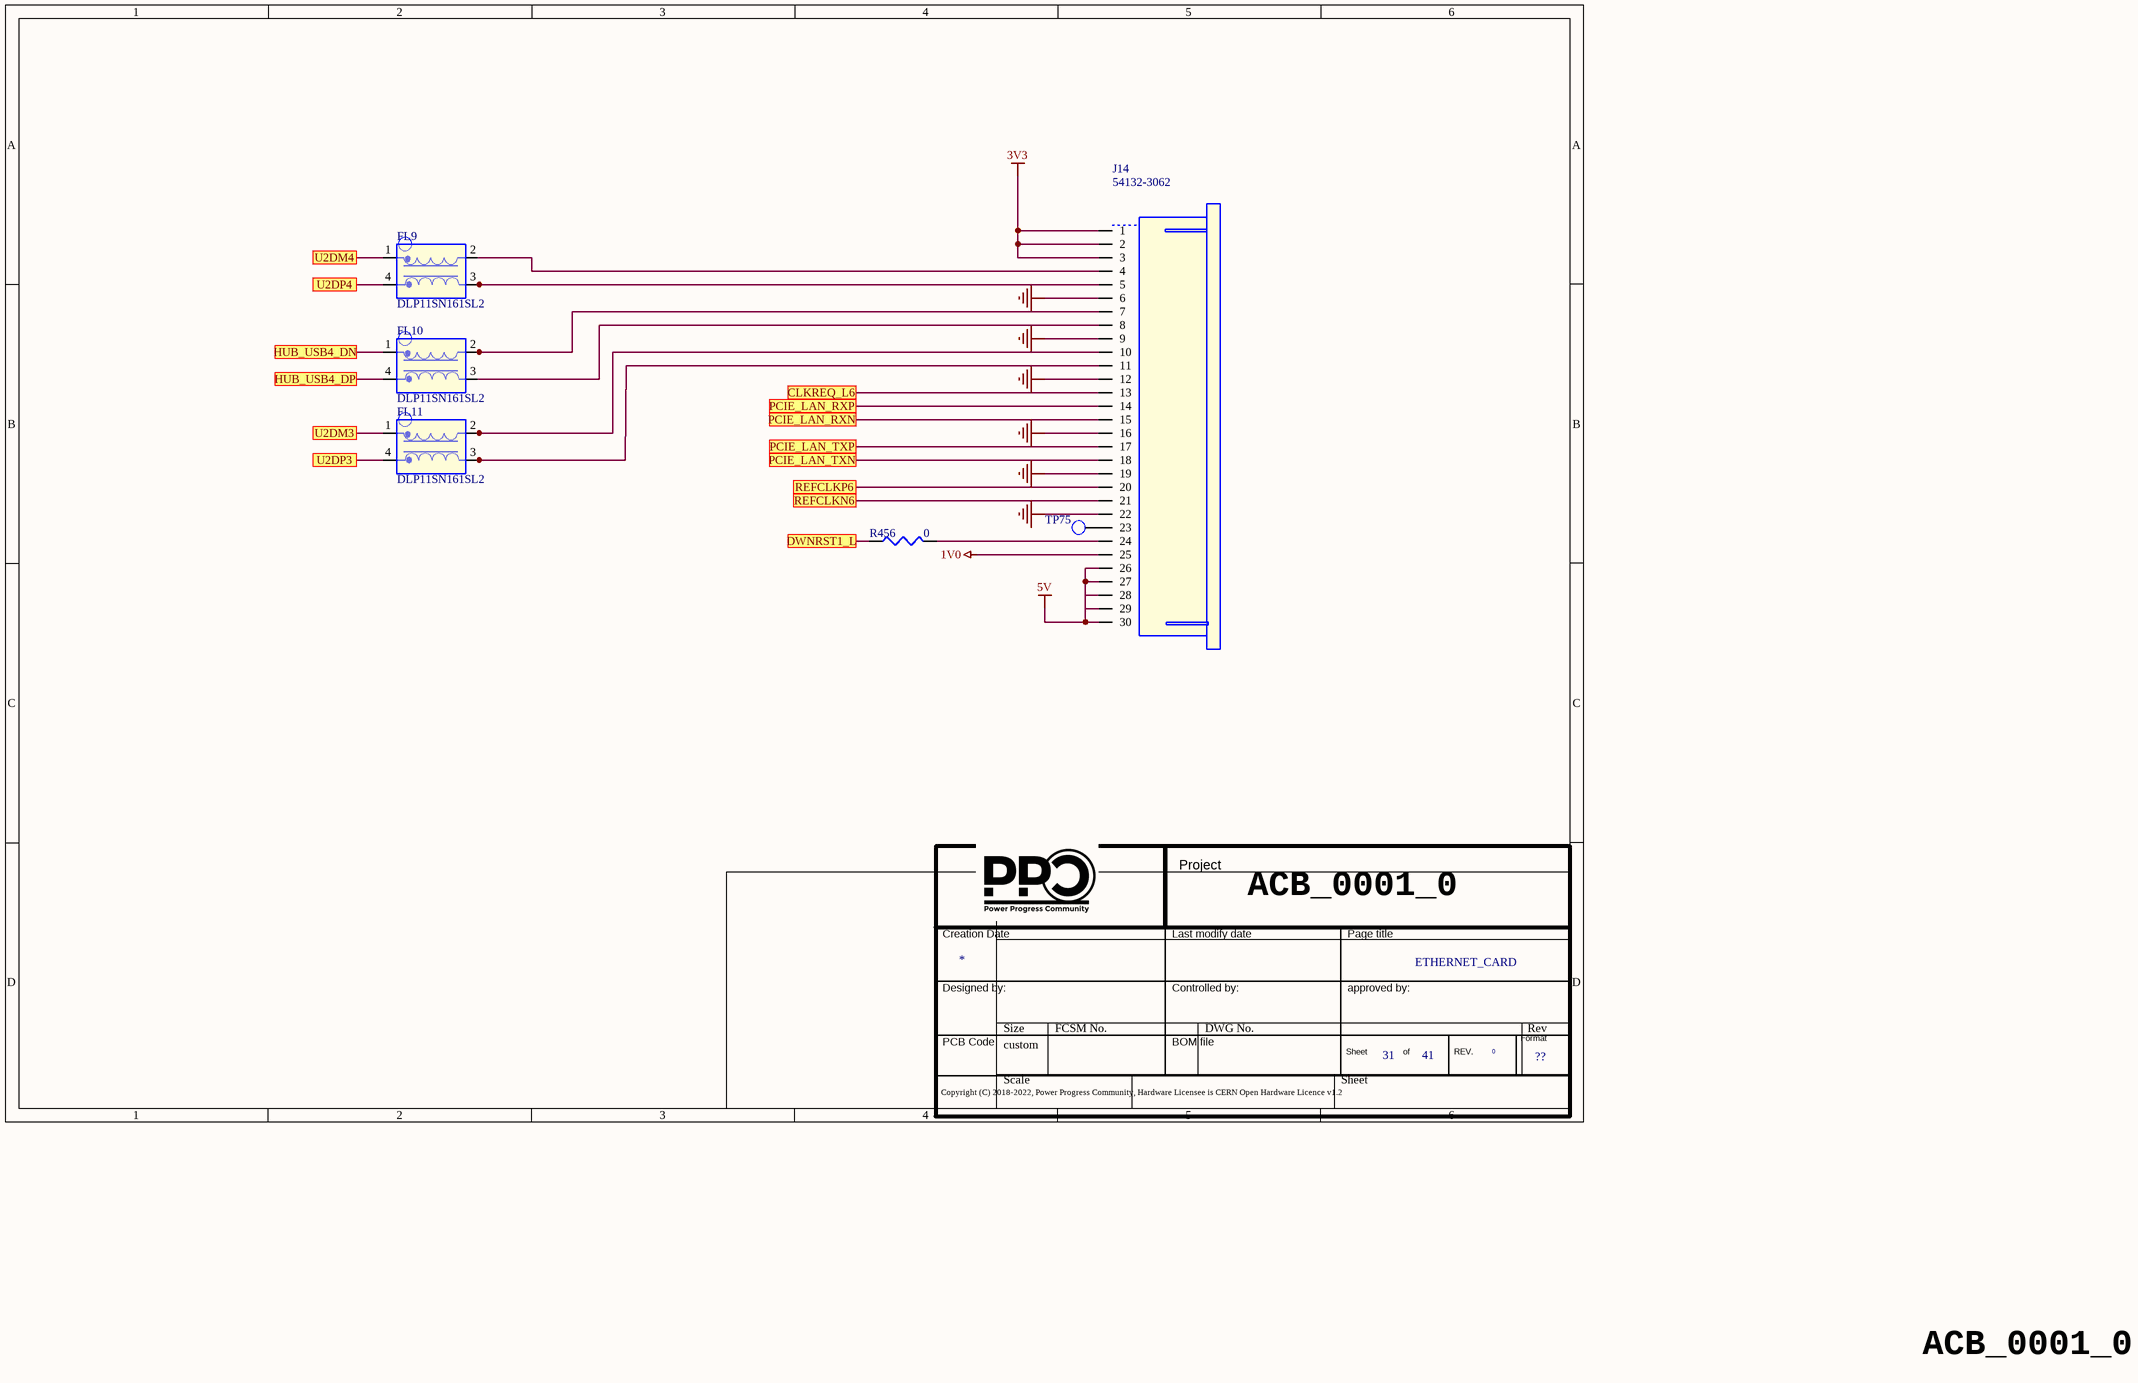
[diagram p37: 18B_ETHERNET CARD.SchDoc]

### Parts
(Parts that share a designator on the sheet are numbered #1, #2 ... from top to bottom, then left to right.)
*#24  Doc: ETHERNET_CARD  Page Count: 41  Page Number: 31  Page Size: ??  RevCode: 0  (hidden comment: Title_block_PPC)  (graphical)
FL9  DLP11SN161SL2  [SMD]
FL10  DLP11SN161SL2  [SMD]
FL11  DLP11SN161SL2  [SMD]
J14  54132-3062  [30 PIN PASSO 0.5mm]
R456  0  [SMD_0402]
TP75  TEST POINT  [PCB]  (value not drawn)

### Ports
CLKREQ_L6, DWNRST1_L, HUB_USB4_DN, HUB_USB4_DP, PCIE_LAN_RXN, PCIE_LAN_RXP, PCIE_LAN_TXN, PCIE_LAN_TXP, REFCLKN6, REFCLKP6, U2DM3, U2DM4, U2DP3, U2DP4

### Nets
1V0: J14.25
3V3: J14.1 J14.2 J14.3
5V: J14.26 J14.27 J14.28 J14.29 J14.30
GND: J14.6 J14.9 J14.12 J14.16 J14.19 J14.22
CLKREQ_L6: J14.13 ; port CLKREQ_L6
DWNRST1_L: R456.1 ; port DWNRST1_L
NetC568_2: J14.14 ; port PCIE_LAN_RXP
NetC570_2: J14.15 ; port PCIE_LAN_RXN
NetFL9_1: FL9.1 ; port U2DM4
NetFL9_2: FL9.2 J14.4
NetFL9_3: FL9.3 J14.5
NetFL9_4: FL9.4 ; port U2DP4
NetFL10_1: FL10.1 ; port HUB_USB4_DN
NetFL10_2: FL10.2 J14.7
NetFL10_3: FL10.3 J14.8
NetFL10_4: FL10.4 ; port HUB_USB4_DP
NetFL11_1: FL11.1 ; port U2DM3
NetFL11_2: FL11.2 J14.10
NetFL11_3: FL11.3 J14.11
NetFL11_4: FL11.4 ; port U2DP3
NetJ14_17: J14.17 ; port PCIE_LAN_TXP
NetJ14_18: J14.18 ; port PCIE_LAN_TXN
NetJ14_20: J14.20 ; port REFCLKP6
NetJ14_21: J14.21 ; port REFCLKN6
NetJ14_23: J14.23 TP75.1(TP)
NetJ14_24: J14.24 R456.2

### Notes on the sheet
- ACB_0001_0

### Library data of the parts
*#24 = Title_block_PPC: Title: T2080PCIe; Author: MICETEK; Page Create Date: March  8, 1995; Page Title: ?; Page Modify Date: *
FL9 FL11 = USB_CHOKE: CHOKE COMMON MODE 90 OHM 0805; Manufacturer Part Number 1: DLW21HN900SQ2L; Manufacturer 1: Murata; Part Number: PASSIVE_1366; RSM: EMI-DLW21; Distributor 1: DIGIKEY(490-1064-1-ND); Part Type: FILTER; PCB Footprint: SMD
FL10 = USB_CHOKE: CHOKE COMMON MODE 90 OHM 0805; Part Number: PASSIVE_1366; Manufacturer 1: Murata; Manufacturer Part Number 1: DLW21HN900SQ2L; RSM: EMI-DLW21; Part Type: FILTER; Distributor 1: DIGIKEY(490-1064-1-ND); PCB Footprint: SMD
J14 = ZIF_30: CONN FPC/FFC .50mm 30 pos bot contact; Part Number: CONNECTORS_593; VAL: 54132-4097; FAB: MOLEX; BOI: 40 pins; DESIG: FPC CONNECTOR ZIP; DEV: JFS_54132ZIF40P_01; RSM: MOLEX-54132-060-30; REF: 54132-4097; PCB Footprint: 30 PIN PASSO 0.5mm; Distributor 1: MOUSER(538-54132-3062); Manufacturer Part Number 1: 54132-3062; Manufacturer 1: MOLEX; Part Type: ZIF
R456 = R_Dup6: as R441-R445 on sheet 17 USB3 CONTROLLER; Manufacturer Part Number 1: RESIS.CHIP 0R 5% 0402 SMD; Part Type: Resistors\Fixed\SMD\0402\5%; PCB Footprint: SMD_0402
TP75 = T POINT R: TEST POINT SU PCB; Part Number: CONNECTORS_542; RSM: AE-TESTPOINT; Part Type: Tpoint; PCB Footprint: PCB